# EAGLE design Soil_moisture (EAGLE 9.3.1)
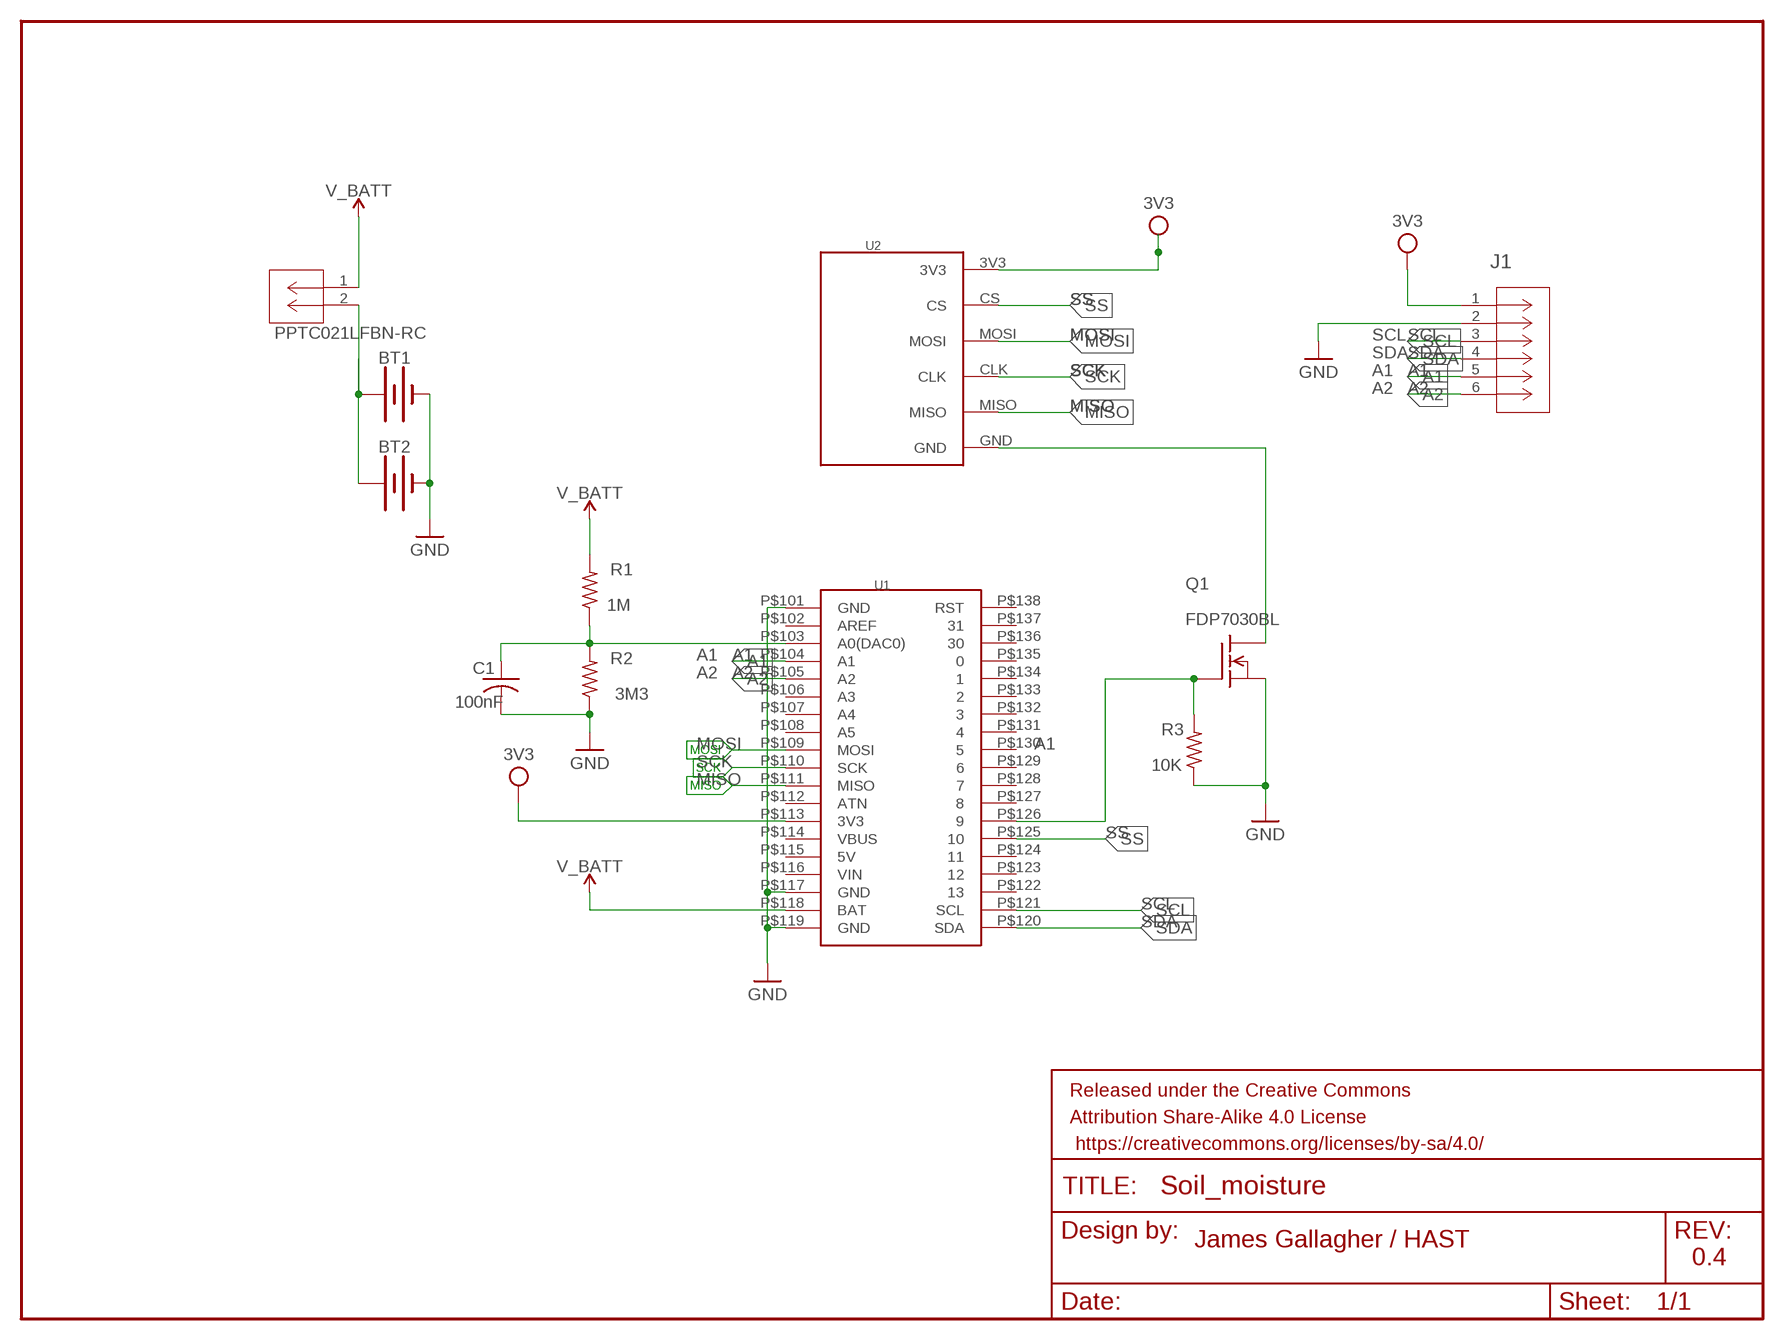
[diagram p0: schematic, sheet 1]

## Parts
BAT_GND  PPTC021LFBN-RC  [CONN2_LFBN-RC_SUL]
BT1  BATTERY-AA_KIT  [BATTERY-AA-KIT]
BT2  BATTERY-AA_KIT  [BATTERY-AA-KIT]
C1  100nF  C-US050-035X075  [C050-035X075]
FRAME1  FRAME-LETTER  [CREATIVE_COMMONS]
J1  1725698  [CONN_1725698_PXC]
Q1  FDP7030BL  SUP75N06-08  [TO220]
R1  1M  R-US_0309/10  [0309/10]
R2  3M3  R-US_0309/10  [0309/10]
R3  10K  R-US_0309/10  [0309/10]
U1  RS_MINI_ULTRA_PRO_V2  [RS_MINI_ULTRA_PRO_V2]
U2  SD_BREAKOUT_EBAY  [SD_BREAKOUT_EBAY]

## Nets
3V3: U1.P$113(3V3)
A1: J1.5 U1.P$104(A1)
A2: J1.6 U1.P$105(A2)
GND: BT1.GND@1(-) BT2.GND@1(-) C1.2 J1.2 Q1.3(S) R2.1 R3.1 U1.P$101(GND) U1.P$117(GND) U1.P$119(GND)
MISO: U1.P$111(MISO) U2.MISO
MOSI: U1.P$109(MOSI) U2.MOSI
N$1: Q1.2(D) U2.GND
N$2: C1.1 R1.1 R2.2 U1.P$103(A0(DAC0))
N$3: Q1.1(G) R3.2 U1.P$126
N$6: BAT_GND.2 BT1.PWR@1(+) BT2.PWR@1(+)
SCK: U1.P$110(SCK) U2.CLK
SCL: J1.3 U1.P$121(SCL)
SDA: J1.4 U1.P$120(SDA)
SS: U1.P$125 U2.CS
V_BATT: BAT_GND.1 R1.2 U1.P$118(BAT)
VCC: J1.1 U2.3V3 ; supply symbol labelled 3V3
Unconnected: U1.P$102(AREF) U1.P$106(A3) U1.P$107(A4) U1.P$108(A5) U1.P$112(ATN) U1.P$114(VBUS) U1.P$115(5V) U1.P$122 U1.P$123 U1.P$124 U1.P$127 U1.P$128 U1.P$129 U1.P$130 U1.P$131 U1.P$132 U1.P$133 U1.P$134 U1.P$135 U1.P$136 U1.P$137 U1.P$138(RST)

## Notes on the sheet
- James Gallagher / HAST
- 0.4

## Power pins joined to a net without a drawn wire
VIN: U1.P$116(VIN)

## Library data of the parts
BAT_GND = my_library:PPTC021LFBN-RC; BUILT_BY: EMA_Matt; COPYRIGHT: Copyright (C) 2018 Accelerated Designs. All rights reserved; DATASHEET: https://drawings-pdf.s3.amazonaws.com/10492.pdf; MANUFACTURER_PART_NUMBER: PPTC021LFBN-RC; SOURCELIBRARY: Sullins_2020-09-28; VENDOR: Sullins
BT1 BT2 = SparkFun-Batteries:BATTERY: Battery - Single Cell A variety of battery chemistries, sizes, and footprints. Device List: 20MM_PTH - Coin Cell Battery Holder - 20mm (PTH) <https://www.sparkfun.com/products/783> 6.8MM_PTH - Coin Cell Battery Holder - 6.8MM(SMD) <https://www.digikey.com/product-detail/en/seiko-instruments/MS621FE-FL11E/728-1057-ND/1889208?WT.srch=1&gclid=CNOQ5a6LzdQCFZS2wAodXCkE0g> 12MM_SMD - Coin Cell Battery Holder - 12mm (SMD) <https://www.sparkfun.com/products/10592> 12MM_PTH - Coin Cell Battery Holder - 12mm (PTH) <https://www.sparkfun.com/products/7948> 20MM_SMD - 20mm Coin Cell Battery Holder (SMD) (2 legs) Used on the Big Time Watch Kit <https://www.sparkfun.com/products/11734> 20MM_SMD_4LEGS - Coin Cell Battery Holder - 20mm (SMD) <https://www.sparkfun.com/products/11892> 20MM_SMD_4LEGS_OVERPASTE - Coin Cell Battery Holder - 20mm (SMD) <https://www.sparkfun.com/products/11892> (Over-paste on the legs) 24.5MM_PTH - Coin Cell Battery Holder - 24.5mm (PTH) <https://www.sparkfun.com/products/8863> 9V - 9V Battery Holder - PC Mount Used on the SparkFun SparkPunk Sound Kit <https://www.sparkfun.com/products/11177> and SparkFun SparkPunk Sequencer Kit <https://www.sparkfun.com/products/12707> 18650 - Battery Holder - 18650 (PTH) <https://www.sparkfun.com/products/13113> AA - Battery Holder - 1xAA (PTH) <https://www.sparkfun.com/products/7949> AAA - Battery Holder - 1xAAA (PTH) <https://www.sparkfun.com/products/12718> AA_KIT - Battery Holder - 1xAA (PTH) <https://www.sparkfun.com/products/7949> Special kit package - pads only have exposed copper on one side of the board. AAA_KIT - Battery Holder - 1xAAA (PTH) <https://www.sparkfun.com/products/12718> Special kit package - pads only have exposed copper on one side of the board.; PROD_ID: BATT-08316; SF_SKU: PRT-07949
C1 = adafruit:C-US: CAPACITOR, American symbol
FRAME1 = SparkFun-Aesthetics:FRAME-LETTER: Schematic Frame - Letter Standard 8.5x11 US Letter frame
J1 = my_library:1725698; ARTICLE_DESCRIPTION: MPT 0,5/ 6-2,54; BUILT_BY: EMA_Anthony; CONTACT_TYPE: Unknown; COPYRIGHT: Copyright (C) 2018 Accelerated Designs. All rights reserved; MANUFACTURER_PART_NUMBER: 1725698; NUMBER_OF_CONNECTION: 6; NUMBER_OF_POSITION_PER_ROW: 6; NUMBER_OF_POTENTIALS: 6; NUMBER_OF_ROWS: 1; NUMBER_OF_SOLDER_PINS_PER_POTENTIALS: 1; PITCH__MM_: 2.54; PLUG_SYSTEM: Unknown; PRODUCTTYP: Printed circuit board terminal; PRODUCT_FAMILY: MPT 0,5; SOLDER_PIN_LENGTH__MM_: 3.5; SOURCELIBRARY: Phoenix_Contact_2020-03-19; VENDOR: Phoenix Contact
Q1 = transistor-fet:SUP75N06-08: N-Channel Enhancement MOSFET 60V; 75A; 0,008Ohm
R1-R3 = adafruit:R-US_: RESISTOR, American symbol
U1 = my_library:RS_MINI_ULTRA_PRO_V2: RocketScream Mini-Ultra Pro, V2 <https://www.rocketscream.com/blog/docs-item/mini-ultra-pro-hookup-guide/#tab-id-2-active> ATSAMD21G18A-AU 48MHz 3.3v RFM95 LoRa
U2 = my_library:SD_BREAKOUT_EBAY: Friction SD Card holder from EBay. Supports SPI Bus only.

## Net classes
0 default: width 0.305 mm, drill 0.508 mm, clearance 0.254 mm

## Board
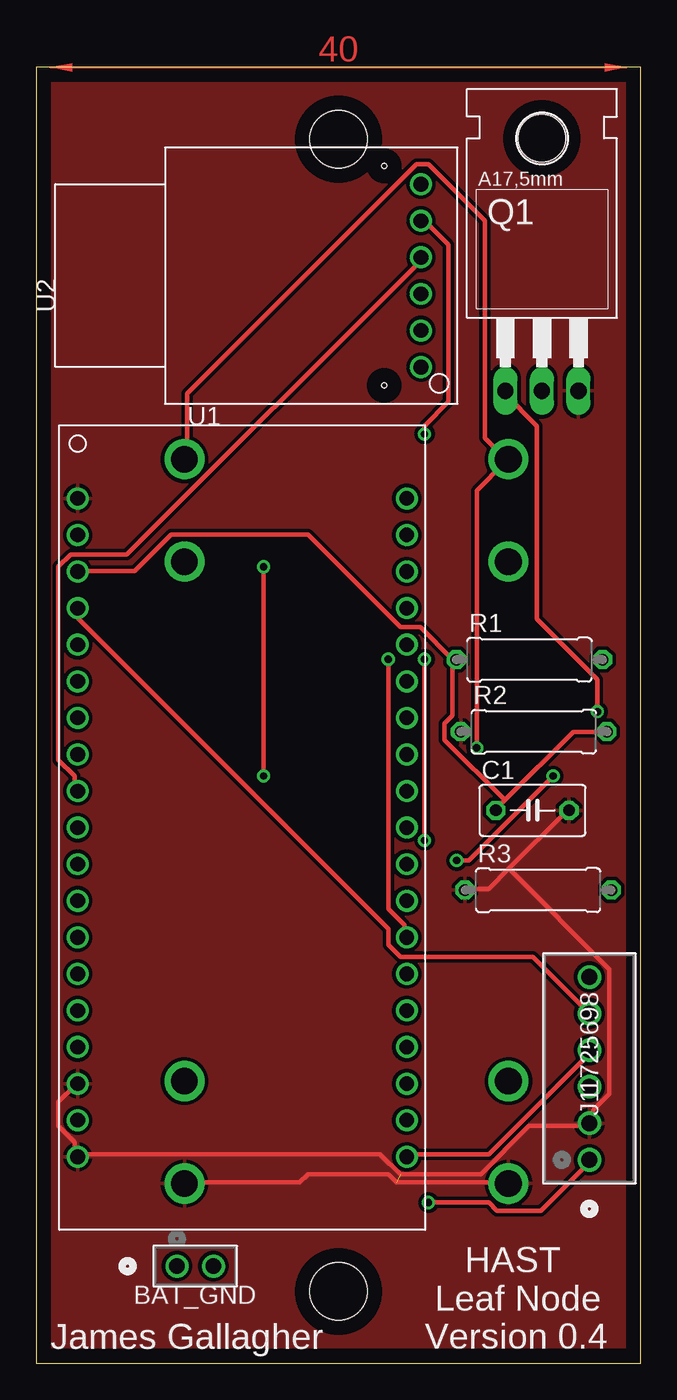
[diagram p1: board, top side]
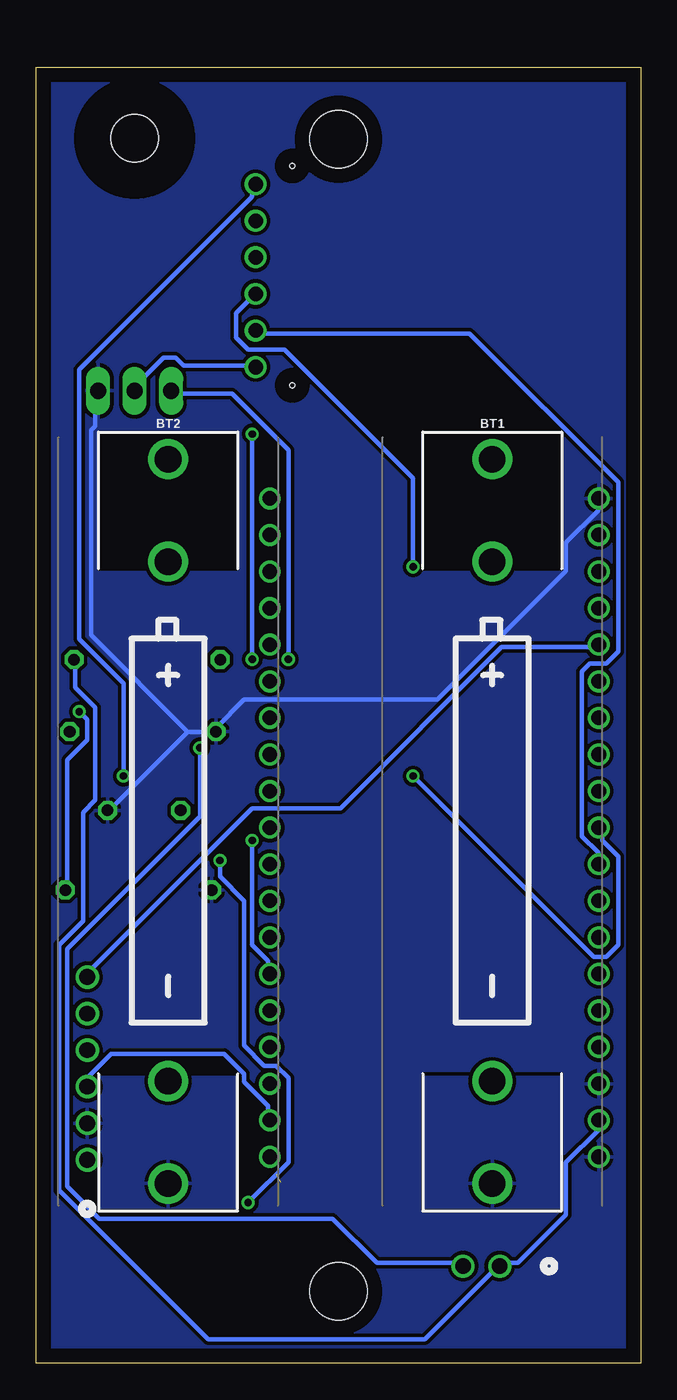
[diagram p2: board, bottom side, seen from below]

Size 42 x 90 mm. Coordinates in mm from the lower left corner, seen from the top.
Outline: 0,0 42,0 42,90 0,90 0,0
Copper layers (1*16): Top 0.035mm / dielectric 1.5mm / Bottom 0.035mm
Design rules "default": minimum track width 6mil, minimum drill 0.35mm, track to track 6mil, track to pad 6mil, pad to pad 6mil, via to via 6mil, smd to smd 6mil, copper to edge 40mil, drill to drill 6mil, minimum pad ring 10mil, minimum via ring 8mil, stop-mask expansion 4mil, vias tented up to drill 0mil, thermal gap 10mil
Holes 4 mm at 21,85 21,5

### Footprints (pad centres in the part's own frame; a part is rotated, then mirrored left to right if it is on the bottom)
CONN2_LFBN-RC_SUL = drill 1.067 pad 1.575: 1 0,0; 2 2.54,0
BATTERY-AA-KIT = drill 1.854: GND@1 25.146,0; GND@2 18.034,0; PWR@1 -25.146,0; PWR@2 -18.034,0
C050-035X075 = drill 0.813 octagon: 1 -2.54,0; 2 2.54,0
CONN_1725698_PXC = drill 1.092 pad 1.6: 1 0,0; 2 2.54,0; 3 5.08,0; 4 7.62,0; 5 10.16,0; 6 12.7,0
TO220 = drill 1.118 long: 1 -2.54,-6.35; 2 0,-6.35; 3 2.54,-6.35 | hole 3.302: 0,11.176
0309/10 = drill 0.813 octagon: 1 -5.08,0; 2 5.08,0
RS_MINI_ULTRA_PRO_V2 = drill 1.016: P$101 -11.43,22.86; P$102 -11.43,20.32; P$103 -11.43,17.78; P$104 -11.43,15.24; P$105 -11.43,12.7; P$106 -11.43,10.16; P$107 -11.43,7.62; P$108 -11.43,5.08; P$109 -11.43,2.54; P$110 -11.43,0; P$111 -11.43,-2.54; P$112 -11.43,-5.08; P$113 -11.43,-7.62; P$114 -11.43,-10.16; P$115 -11.43,-12.7; P$116 -11.43,-15.24; P$117 -11.43,-17.78; P$118 -11.43,-20.32; P$119 -11.43,-22.86; P$120 11.43,-22.86; P$121 11.43,-20.32; P$122 11.43,-17.78; P$123 11.43,-15.24; P$124 11.43,-12.7; P$125 11.43,-10.16; P$126 11.43,-7.62; P$127 11.43,-5.08; P$128 11.43,-2.54; P$129 11.43,0; P$130 11.43,2.54; P$131 11.43,5.08; P$132 11.43,7.62; P$133 11.43,10.16; P$134 11.43,12.7; P$135 11.43,15.24; P$136 11.43,17.78; P$137 11.43,20.32; P$138 11.43,22.86
SD_BREAKOUT_EBAY = drill 1.016: 3V3 5.08,0; CLK -2.54,0; CS 2.54,0; GND -7.62,0; MISO -5.08,0; MOSI 0,0 | hole 0.35: -8.89,2.54; 6.35,2.54

### Placement (x,y rotation side)
BAT_GND  9.79,6.76 0 top
BT1  10.31,37.64 270 bottom
BT2  32.82,37.64 270 bottom
C1  34.49,38.41 0 top
FRAME1  -19.01,102.71 0 top  (outside the outline)
J1  38.44,14.14 90 top
Q1  35.15,73.89 0 top
R1  34.28,48.87 0 top
R2  34.58,43.87 0 top
R3  34.88,32.87 0 top
U1  14.33,37.21 0 top
U2  26.74,76.81 90 top

### Tracks (layer width: path | path; a pad name or v marks a point on that pad's centre or on a via)
A1
  Top 0.305: U1.P$104 2.96,52.25 2.96,51.69 24.47,30.18 24.47,29.06 25.31,28.22 34.53,28.22 J1.5
A2
  Bottom 0.305: U1.P$105 2.96,49.73 9.66,49.73 20.84,38.56 26.98,38.56 38.44,27.1 J1.6
GND  (1 unrouted)
  Top 0.305: U1.P$117 2.68,19.28 1.56,18.16 1.56,16.48 2.68,15.37 2.68,14.53 U1.P$119 2.96,14.53 23.91,14.53 25.31,13.13 30.9,13.13 34.25,16.48 38.44,16.48 J1.2 38.72,16.76 38.72,17.6 39.84,18.72 39.84,27.38 32.85,34.37 | 32.85,34.37 36.76,38.28 C1.2 | 32.85,34.37 31.45,32.97 30.06,32.97 R3.1 | BT1.GND@1 10.5,12.57 18.32,12.57 18.88,13.13 24.47,13.13 25.03,12.57 32.57,12.57 BT2.GND@1
  Bottom 0.305: 31.45,43.87 29.78,43.87 R2.1 29.5,44.15 27.54,46.1 14.13,46.1 5.19,55.04 5.19,57 2.96,59.23 2.96,59.79 U1.P$101 | 31.45,43.87 36.76,38.56 C1.2 | 31.45,43.87 38.16,50.57 38.16,64.82 37.88,65.1 37.88,67.33 Q1.3
  pour Top: -1,92 0,93 43,93 43,-1 -2,-1 -2,91
  pour Bottom: -1,91 0,92 43,92 43,-1 -1,-1
MISO
  Bottom 0.305: U1.P$111 2.96,34.92 2.96,35.48 4.07,36.6 4.07,48.06 3.52,48.62 2.4,48.62 1.56,49.45 1.56,61.19 11.9,71.53 26.7,71.53 U2.MISO
MOSI
  Top 0.305: U1.P$109 2.68,39.95 2.68,40.79 1.56,41.91 1.56,55.32 2.4,56.16 6.31,56.16 26.7,76.56 U2.MOSI
N$1
  Bottom 0.305: U2.GND 26.98,69.29 31.73,69.29 32.29,69.85 33.13,69.85 35.37,67.61 Q1.2
N$2
  Top 0.305: 32.57,39.12 37.32,43.87 39.56,43.87 R2.2 | 32.57,39.12 32.01,38.56 C1.1 | 32.57,39.12 28.38,43.31 28.38,44.42 28.94,44.98 28.94,48.62 R1.1 28.94,48.9 26.7,51.13 25.31,51.13 18.88,57.56 9.38,57.56 6.87,55.04 2.96,55.04 U1.P$103
N$3  (via drill 0.51)
  Top 0.305: v39,45.26 39,47.5 34.81,51.69 34.81,65.1 32.57,67.33 Q1.1 | v24.47,48.9 24.47,31.57 25.59,30.45 25.59,29.62 U1.P$126
  Bottom 0.305: v39,45.26 38.44,44.7 38.44,43.31 39.84,41.91 39.84,32.97 R3.2 | v24.47,48.9 24.47,63.42 28.38,67.33 32.57,67.33 Q1.1
N$6  (via drill 0.51)
  Top 0.305: v30.62,42.75 30.62,60.63 32.57,62.59 BT2.PWR@1 32.57,62.87 31.18,64.26 31.18,79.35 27.26,83.26 26.43,83.26 10.5,67.33 10.5,62.87 BT1.PWR@1
  Bottom 0.305: v30.62,42.75 30.62,38 39.84,28.78 39.84,12.29 37.6,10.06 21.4,10.06 18.32,6.99 12.46,6.99 BAT_GND.2
SCK  (via drill 0.51)
  Top 0.305: v15.81,55.32 v15.81,40.79
  Bottom 0.305: v15.81,40.79 3.23,28.22 2.4,28.22 1.56,29.06 1.56,35.2 2.68,36.32 2.68,37.16 U1.P$110 | v15.81,55.32 15.81,61.47 24.75,70.41 27.26,70.41 28.1,71.25 28.1,72.92 26.98,74.04 U2.CLK
SCL
  Bottom 0.305: U1.P$121 25.87,17.04 25.87,17.88 27.54,19.56 27.54,20.12 28.94,21.51 36.76,21.51 38.44,19.84 38.44,19.28 J1.3
SDA
  Top 0.305: U1.P$120 25.87,14.53 31.45,14.53 38.44,21.51 J1.4
SS  (via drill 0.51)
  Top 0.305: v26.98,48.9 v26.98,36.32 | v26.98,64.54 26.98,65.1 28.66,66.78 28.66,77.67 26.98,79.35 U2.CS
  Bottom 0.305: v26.98,36.32 26.98,29.06 25.87,27.94 25.87,27.1 U1.P$125 | v26.98,64.54 v26.98,48.9
V_BATT
  Bottom 0.305: R1.2 39.28,48.62 39.28,46.94 37.88,45.54 37.88,39.12 38.72,38.28 38.72,30.73 40.4,29.06 40.4,12.01 30.06,1.68 14.97,1.68 9.94,6.71 BAT_GND.1 9.66,6.99 8.54,6.99 5.19,10.34 5.19,13.97 2.96,16.2 2.96,16.76 U1.P$118
VCC  (via drill 0.51)
  Top 0.305: v35.92,40.79 30.06,34.92 v29.22,34.92 | v27.26,11.18 31.45,11.18 32.01,10.62 35.09,10.62 38.44,13.97 J1.1
  Bottom 0.305: v35.92,40.79 35.92,47.22 39,50.29 39,69.01 26.98,81.03 26.98,81.86 U2.3V3 | v29.22,34.92 29.22,33.81 27.54,32.13 27.54,22.07 26.15,20.68 25.31,20.68 24.47,19.84 24.47,13.97 v27.26,11.18
(copper drawn outside any net)
  shapes: Top area x3

### Text on the board
tPlace: James Gallagher | HAST / Leaf Node / Version 0.4